# Altium project obc_ver2.PrjPcb (part 3 of 3)
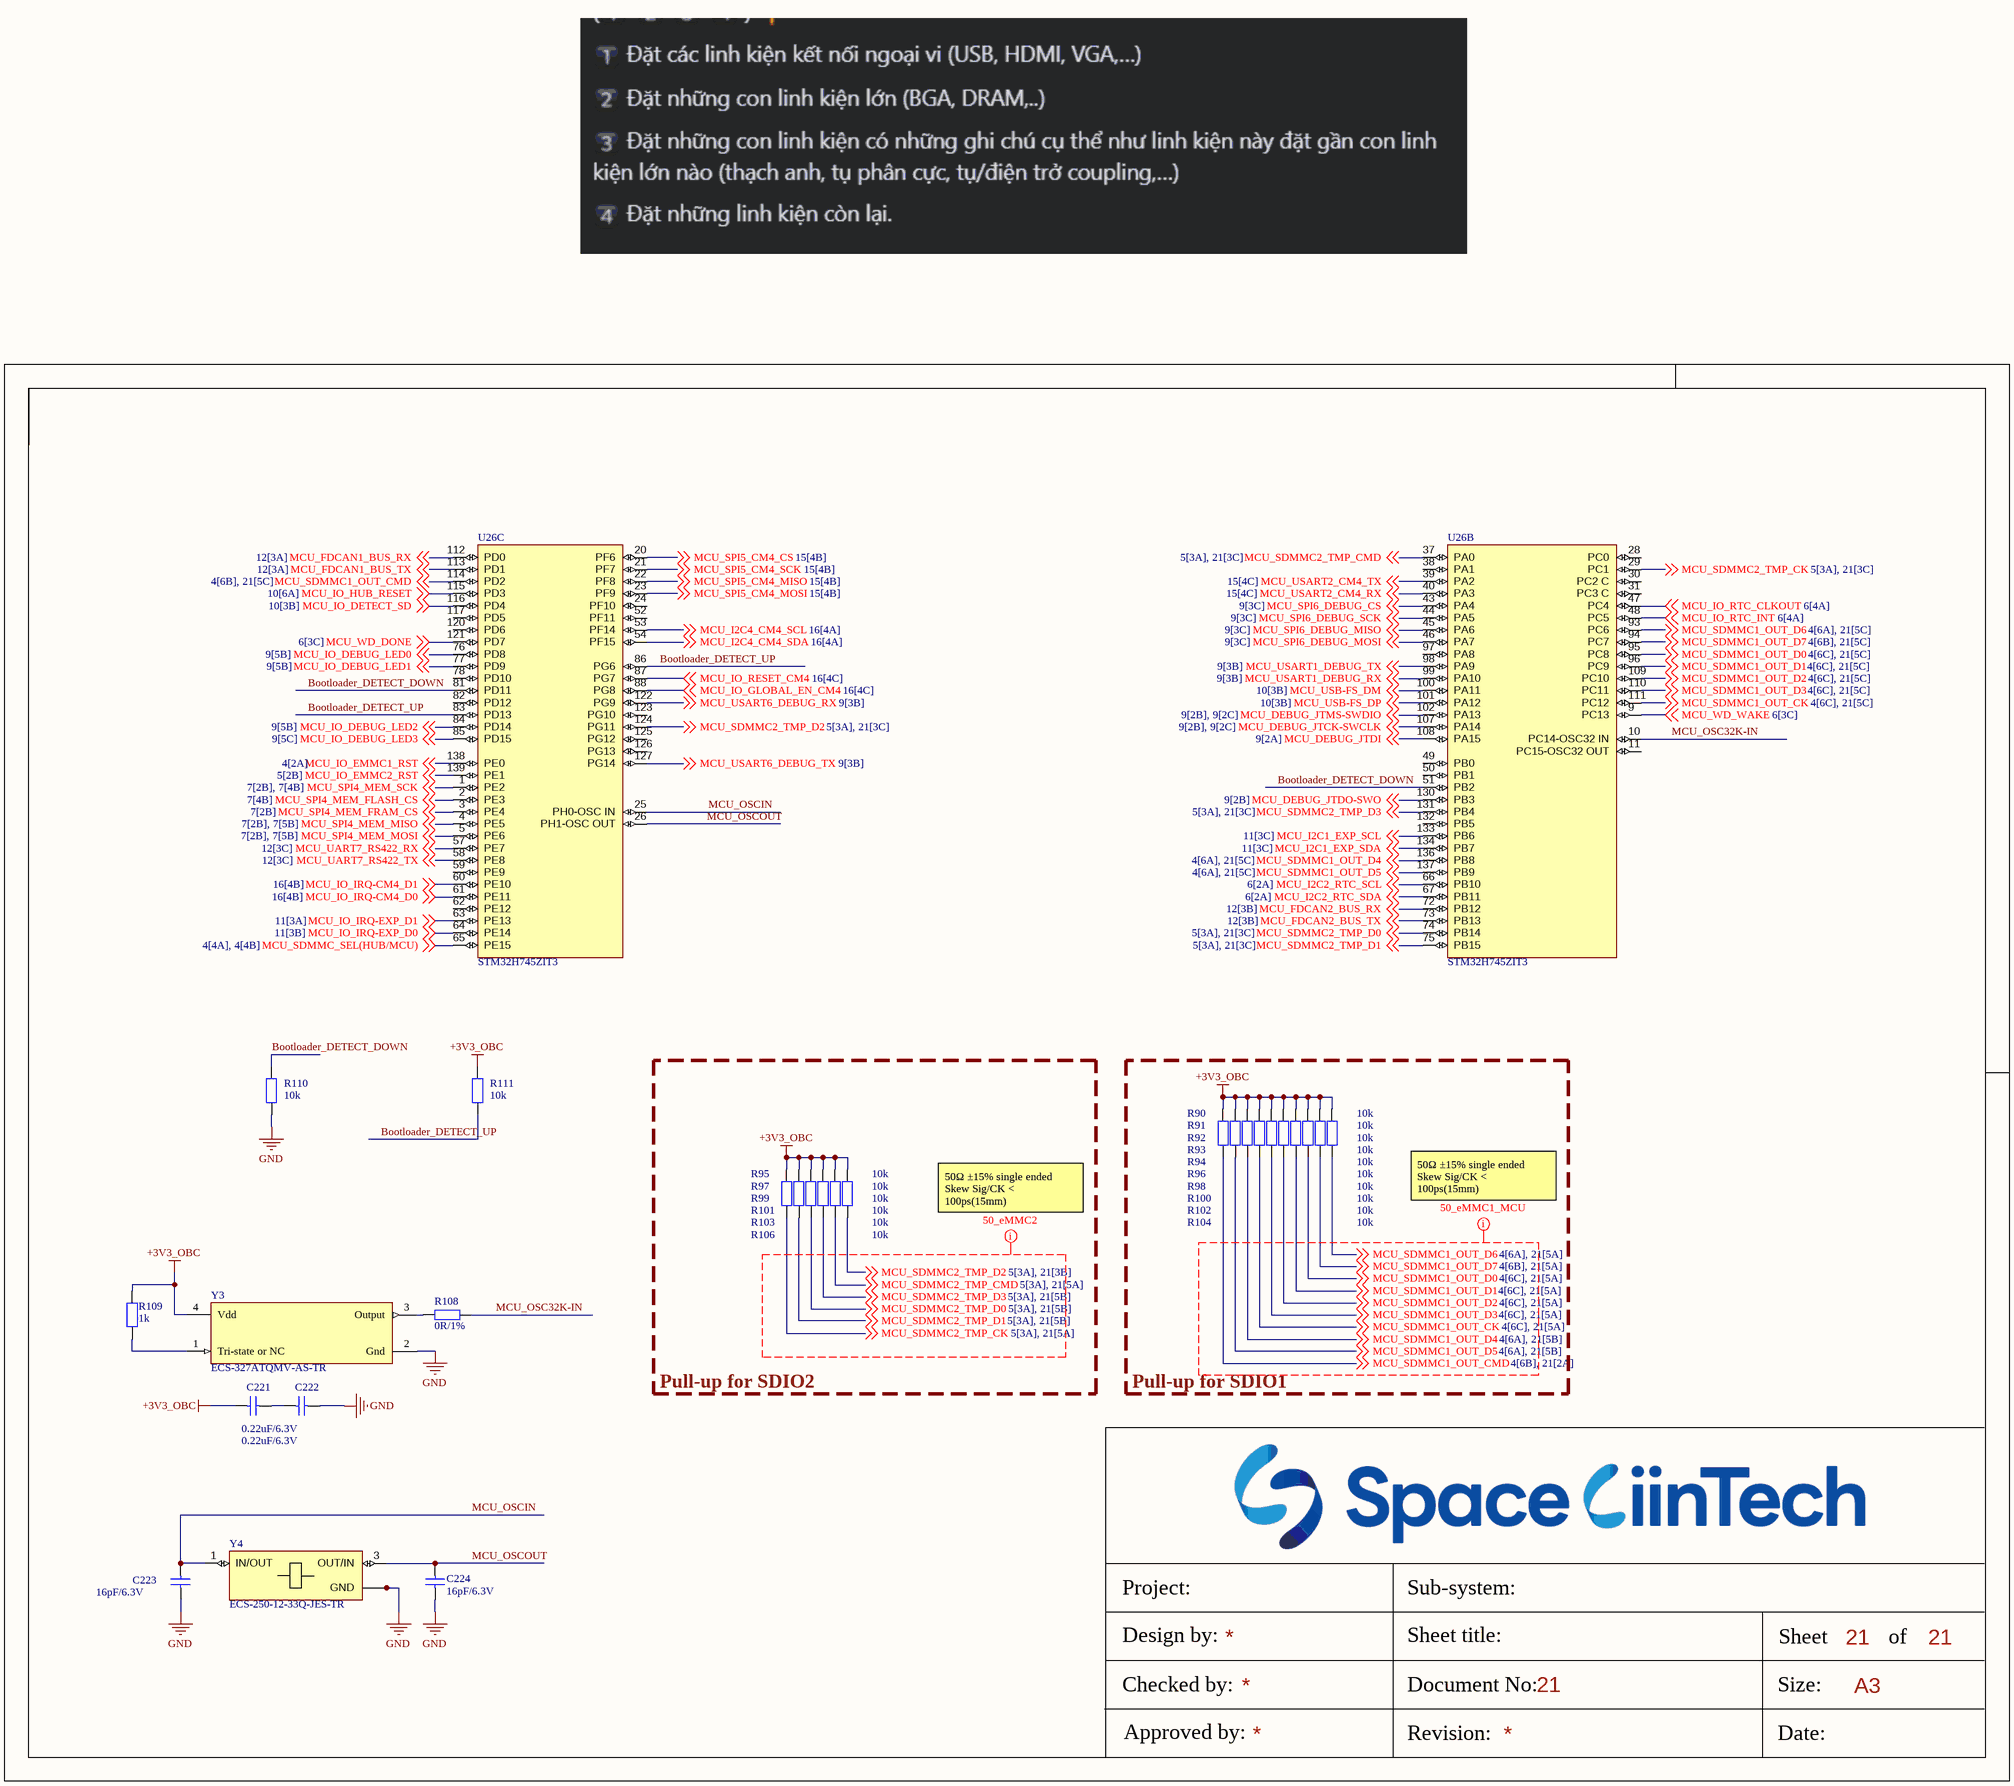
[diagram p23: obc-v2_MCU-PinOut.SchDoc]

## Nets that join several sheets
+3V3_CM4: obc-v2_POWER (C12.1 R3.2 U3.4 U3.5), obc-v2_CM4-PinOut (10 pins), obc-v2_CM4-SPI-UART (6 pins), obc-v2_CM4-IRQ-CTRL (10 pins), obc-v2_CM4-FUNCTION (D16.2 D17.2), obc-v2_CM4-CSI (R85.1 R86.1)
+3V3_CM4-OUT: obc-v2_CM4-PinOut (R63.1), obc-v2_CM4-POWER (CM4.84 CM4.86 R87.2 TP7.0)
+3V3_M2: obc-v2_POWER (C7.1 D2.2 U2.2 U2.4), obc-v2_CM4-M2 (16 pins)
+3V3_OBC: obc-v2_POWER (5 pins), obc-v2_OUT-eMMC (31 pins), obc-v2_TMP-eMMC (27 pins), obc-v2_RTC-WDOG (11 pins), obc-v2_FRAM-FLASH (8 pins), obc-v2_DEBUG (J6.1 J7.7), obc-v2_USB-HUB (31 pins), obc-v2_EXP-I2C-IRQ (8 pins), obc-v2_EXP-CAN-RS422 (10 pins), obc-v2_CM4-PinOut (5 pins), obc-v2_CM4-SPI-UART (5 pins), obc-v2_CM4-IRQ-CTRL (12 pins), obc-v2_MCU-POWER (41 pins), obc-v2_MCU-PinOut (20 pins)
+5V_AUX-Adaptor: obc-v2_POWER (7 pins), obc-v2_BOARD-CONNECT (J3.21 J18.05 J18.07 J18.09), obc-v2_CM4-PinOut (J20.2), obc-v2_CM4-POWER (14 pins)
+5V_EXP-ISO: obc-v2_BOARD-CONNECT (J3.9), obc-v2_EXP-I2C-IRQ (9 pins), obc-v2_EXP-CAN-RS422 (6 pins)
+5V_USB-Adaptor: obc-v2_POWER (C1.1 C3.1 U1.1 U1.2), obc-v2_BOARD-CONNECT (5 pins)
GND: obc-v2_POWER (6 pins), obc-v2_OUT-eMMC (39 pins), obc-v2_TMP-eMMC (29 pins), obc-v2_RTC-WDOG (11 pins), obc-v2_FRAM-FLASH (C65.2 C68.1 U10.4 U11.4), obc-v2_BOARD-CONNECT (C70.1 D5.2 J4.5 J18.04), obc-v2_DEBUG (12 pins), obc-v2_USB-HUB (36 pins), obc-v2_EXP-I2C-IRQ (C106.2 C110.2 U15.4 U16.4), obc-v2_EXP-CAN-RS422 (8 pins), obc-v2_CM4-PinOut (5 pins), obc-v2_CM4-SPI-UART (5 pins), obc-v2_CM4-IRQ-CTRL (6 pins), obc-v2_MCU-POWER (40 pins), obc-v2_MCU-PinOut (7 pins)
GND_CM4: obc-v2_POWER (11 pins), obc-v2_BOARD-CONNECT (12 pins), obc-v2_CM4-M2 (23 pins), obc-v2_CM4-PinOut (18 pins), obc-v2_CM4-SPI-UART (5 pins), obc-v2_CM4-IRQ-CTRL (6 pins), obc-v2_CM4-FUNCTION (7 pins), obc-v2_CM4-POWER (60 pins)
GND_EXP: obc-v2_BOARD-CONNECT (6 pins), obc-v2_EXP-I2C-IRQ (5 pins), obc-v2_EXP-CAN-RS422 (7 pins)
CAM0_CK_N: obc-v2_BOARD-CONNECT (J3.15), obc-v2_CM4-CSI (CM4.140)
CAM0_CK_P: obc-v2_BOARD-CONNECT (J3.36), obc-v2_CM4-CSI (CM4.142)
CAM0_D0_N: obc-v2_BOARD-CONNECT (J3.11), obc-v2_CM4-CSI (CM4.128)
CAM0_D0_P: obc-v2_BOARD-CONNECT (J3.32), obc-v2_CM4-CSI (CM4.130)
CAM0_D1_N: obc-v2_BOARD-CONNECT (J3.13), obc-v2_CM4-CSI (CM4.134)
CAM0_D1_P: obc-v2_BOARD-CONNECT (J3.34), obc-v2_CM4-CSI (CM4.136)
CM4_ENABLE: obc-v2_CM4-IRQ-CTRL (U25.2), obc-v2_CM4-FUNCTION (J23.1 R81.2)
CM4_I2C4_ToCAM_SCL: obc-v2_BOARD-CONNECT (J3.20), obc-v2_CM4-PinOut (CM4.37)
CM4_I2C4_ToCAM_SDA: obc-v2_BOARD-CONNECT (J3.41), obc-v2_CM4-PinOut (CM4.30)
CM4_I2C_ToCAM_SCL: obc-v2_BOARD-CONNECT (J3.17), obc-v2_CM4-CSI (CM4.35 R86.2)
CM4_I2C_ToCAM_SDA: obc-v2_BOARD-CONNECT (J3.38), obc-v2_CM4-CSI (CM4.36 R85.2)
CM4_I2CSlave_ToOBC_SCL: obc-v2_CM4-PinOut (CM4.38), obc-v2_CM4-IRQ-CTRL (R71.1 U27.3)
CM4_I2CSlave_ToOBC_SDA: obc-v2_CM4-PinOut (CM4.44), obc-v2_CM4-IRQ-CTRL (R73.1 U27.2)
CM4_IO_ToCAM_CAMIO0: obc-v2_BOARD-CONNECT (J3.37), obc-v2_CM4-CSI (CM4.97)
CM4_IO_ToCAM_CAMIO1: obc-v2_BOARD-CONNECT (J3.16), obc-v2_CM4-PinOut (CM4.24)
CM4_IO_ToCAM_SEL0: obc-v2_BOARD-CONNECT (J3.40), obc-v2_CM4-PinOut (CM4.29)
CM4_IO_ToCAM_SEL1: obc-v2_BOARD-CONNECT (J3.19), obc-v2_CM4-PinOut (CM4.50)
CM4_IO_ToOBC_IRQ0: obc-v2_CM4-PinOut (CM4.45), obc-v2_CM4-IRQ-CTRL (R77.1 U24.2)
CM4_IO_ToOBC_IRQ1: obc-v2_CM4-PinOut (CM4.40), obc-v2_CM4-IRQ-CTRL (R75.1 U24.3)
CM4_RESET: obc-v2_CM4-IRQ-CTRL (U25.3), obc-v2_CM4-FUNCTION (J27.1 R84.2)
CM4_SPI1_ISO_CS: obc-v2_CM4-PinOut (CM4.49), obc-v2_CM4-SPI-UART (R70.1 U22.5)
CM4_SPI1_ISO_MISO: obc-v2_CM4-PinOut (CM4.26), obc-v2_CM4-SPI-UART (U22.6)
CM4_SPI1_ISO_MOSI: obc-v2_CM4-PinOut (CM4.27), obc-v2_CM4-SPI-UART (U22.4)
CM4_SPI1_ISO_SCK: obc-v2_CM4-PinOut (CM4.25), obc-v2_CM4-SPI-UART (U22.3)
CM4_UART3_ToOBC_RX: obc-v2_CM4-PinOut (CM4.34), obc-v2_CM4-SPI-UART (U23.2)
CM4_UART3_ToOBC_TX: obc-v2_CM4-PinOut (CM4.54), obc-v2_CM4-SPI-UART (U23.3)
CM4_USB-FS_HUB_D_N: obc-v2_USB-HUB (U13.3), obc-v2_CM4-PinOut (U20.7)
CM4_USB-FS_HUB_D_P: obc-v2_USB-HUB (U13.4), obc-v2_CM4-PinOut (U20.8)
EMMC1_RST: obc-v2_OUT-eMMC (R5.2 U4.M5), obc-v2_MCU-PinOut (U26.138)
EMMC2_CLK: obc-v2_TMP-eMMC (U7.P6), obc-v2_MCU-PinOut (R95.1 U26.29)
EMMC2_CMD: obc-v2_TMP-eMMC (U7.P5), obc-v2_MCU-PinOut (R103.1 U26.37)
EMMC2_DAT0: obc-v2_TMP-eMMC (U7.K2), obc-v2_MCU-PinOut (R99.1 U26.74)
EMMC2_DAT1: obc-v2_TMP-eMMC (U7.N2), obc-v2_MCU-PinOut (R97.1 U26.75)
EMMC2_DAT2: obc-v2_TMP-eMMC (U7.K3), obc-v2_MCU-PinOut (R106.1 U26.124)
EMMC2_DAT3: obc-v2_TMP-eMMC (U7.N3), obc-v2_MCU-PinOut (R101.1 U26.131)
EMMC2_RST: obc-v2_TMP-eMMC (R9.2 U7.M5), obc-v2_MCU-PinOut (U26.139)
HUB_SDMMC1_CLK: obc-v2_OUT-eMMC (TP2.0 U6.19), obc-v2_USB-HUB (U13.21)
HUB_SDMMC1_CMD: obc-v2_OUT-eMMC (U6.23), obc-v2_USB-HUB (U13.24)
HUB_SDMMC1_D0: obc-v2_OUT-eMMC (U6.18), obc-v2_USB-HUB (U13.18)
HUB_SDMMC1_D1: obc-v2_OUT-eMMC (U6.16), obc-v2_USB-HUB (U13.17)
HUB_SDMMC1_D2: obc-v2_OUT-eMMC (U6.20), obc-v2_USB-HUB (U13.33)
HUB_SDMMC1_D3: obc-v2_OUT-eMMC (U6.22), obc-v2_USB-HUB (U13.32)
HUB_SDMMC1_D4: obc-v2_OUT-eMMC (U5.23), obc-v2_USB-HUB (U13.30)
HUB_SDMMC1_D5: obc-v2_OUT-eMMC (U5.22), obc-v2_USB-HUB (U13.23)
HUB_SDMMC1_D6: obc-v2_OUT-eMMC (U5.20), obc-v2_USB-HUB (U13.20)
HUB_SDMMC1_D7: obc-v2_OUT-eMMC (U5.18), obc-v2_USB-HUB (U13.19)
HUB_USB-FS_D_N: obc-v2_BOARD-CONNECT (D5.4), obc-v2_USB-HUB (U13.43)
HUB_USB-FS_D_P: obc-v2_BOARD-CONNECT (D5.6), obc-v2_USB-HUB (U13.42)
MCU_BOOT0: obc-v2_DEBUG (J7.1), obc-v2_MCU-POWER (R88.2 U26.135)
MCU_DEBUG_JTCK-SWCLK: obc-v2_DEBUG (J6.5 J7.4), obc-v2_MCU-PinOut (U26.107)
MCU_DEBUG_JTDI: obc-v2_DEBUG (J6.3), obc-v2_MCU-PinOut (U26.108)
MCU_DEBUG_JTDO-SWO: obc-v2_DEBUG (J6.6), obc-v2_MCU-PinOut (U26.130)
MCU_DEBUG_JTMS-SWDIO: obc-v2_DEBUG (J6.4 J7.5), obc-v2_MCU-PinOut (U26.102)
MCU_DETECT_SD: obc-v2_USB-HUB (R33.2 U13.14), obc-v2_MCU-PinOut (U26.116)
MCU_FDCAN1_BUS_RX: obc-v2_EXP-CAN-RS422 (U17.3), obc-v2_MCU-PinOut (U26.112)
MCU_FDCAN1_BUS_TX: obc-v2_EXP-CAN-RS422 (R49.1 U17.2), obc-v2_MCU-PinOut (U26.113)
MCU_FDCAN2_BUS_RX: obc-v2_EXP-CAN-RS422 (U18.3), obc-v2_MCU-PinOut (U26.72)
MCU_FDCAN2_BUS_TX: obc-v2_EXP-CAN-RS422 (R52.1 U18.2), obc-v2_MCU-PinOut (U26.73)
MCU_I2C1_EXP_SCL: obc-v2_EXP-I2C-IRQ (R45.1 U16.3), obc-v2_MCU-PinOut (U26.133)
MCU_I2C1_EXP_SDA: obc-v2_EXP-I2C-IRQ (R47.1 U16.2), obc-v2_MCU-PinOut (U26.134)
MCU_I2C2_RTC_SCL: obc-v2_RTC-WDOG (R13.1 U8.4), obc-v2_MCU-PinOut (U26.66)
MCU_I2C2_RTC_SDA: obc-v2_RTC-WDOG (R12.1 U8.5), obc-v2_MCU-PinOut (U26.67)
MCU_I2C4_CM4_SCL: obc-v2_CM4-IRQ-CTRL (R72.1 U27.6), obc-v2_MCU-PinOut (U26.53)
MCU_I2C4_CM4_SDA: obc-v2_CM4-IRQ-CTRL (R74.1 U27.7), obc-v2_MCU-PinOut (U26.54)
MCU_IO_DEBUG_LED0: obc-v2_DEBUG (R24.2), obc-v2_MCU-PinOut (U26.76)
MCU_IO_DEBUG_LED1: obc-v2_DEBUG (R25.2), obc-v2_MCU-PinOut (U26.77)
MCU_IO_DEBUG_LED2: obc-v2_DEBUG (R26.2), obc-v2_MCU-PinOut (U26.84)
MCU_IO_DEBUG_LED3: obc-v2_DEBUG (R27.2), obc-v2_MCU-PinOut (U26.85)
MCU_IO_GLOBAL_EN_CM4: obc-v2_CM4-IRQ-CTRL (R80.1 U25.7), obc-v2_MCU-PinOut (U26.88)
MCU_IO_HUB_RESET: obc-v2_USB-HUB (C76.1 R30.2 TP5.0 U13.38), obc-v2_MCU-PinOut (U26.115)
MCU_IO_IRQ-CM4_D0: obc-v2_CM4-IRQ-CTRL (R78.1 U24.7), obc-v2_MCU-PinOut (U26.61)
MCU_IO_IRQ-CM4_D1: obc-v2_CM4-IRQ-CTRL (R76.1 U24.6), obc-v2_MCU-PinOut (U26.60)
MCU_IO_IRQ-EXP_D0: obc-v2_EXP-I2C-IRQ (R40.1 U15.3), obc-v2_MCU-PinOut (U26.64)
MCU_IO_IRQ-EXP_D1: obc-v2_EXP-I2C-IRQ (R42.1 U15.2), obc-v2_MCU-PinOut (U26.63)
MCU_IO_RESET_CM4: obc-v2_CM4-IRQ-CTRL (R79.1 U25.6), obc-v2_MCU-PinOut (U26.87)
MCU_IO_RTC_CLKOUT: obc-v2_RTC-WDOG (R11.1 U8.3), obc-v2_MCU-PinOut (U26.47)
MCU_IO_RTC_INT: obc-v2_RTC-WDOG (R10.1 U8.7), obc-v2_MCU-PinOut (U26.48)
MCU_~{RST}: obc-v2_RTC-WDOG (C64.1 R16.1 R17.1 TP3.1), obc-v2_DEBUG (J6.8 J7.3), obc-v2_MCU-POWER (U26.27)
MCU_RS422_RX: obc-v2_EXP-CAN-RS422 (R57.1 U19.3), obc-v2_MCU-PinOut (U26.57)
MCU_RS422_TX: obc-v2_EXP-CAN-RS422 (U19.6), obc-v2_MCU-PinOut (U26.58)
MCU_SDMMC1_OUT_CK: obc-v2_OUT-eMMC (U6.13), obc-v2_MCU-PinOut (R93.1 U26.111)
MCU_SDMMC1_OUT_CMD: obc-v2_OUT-eMMC (U6.8), obc-v2_MCU-PinOut (R90.1 U26.114)
MCU_SDMMC1_OUT_D0: obc-v2_OUT-eMMC (U6.14), obc-v2_MCU-PinOut (R100.1 U26.95)
MCU_SDMMC1_OUT_D1: obc-v2_OUT-eMMC (U6.15), obc-v2_MCU-PinOut (R98.1 U26.96)
MCU_SDMMC1_OUT_D2: obc-v2_OUT-eMMC (U6.12), obc-v2_MCU-PinOut (R96.1 U26.109)
MCU_SDMMC1_OUT_D3: obc-v2_OUT-eMMC (U6.10), obc-v2_MCU-PinOut (R94.1 U26.110)
MCU_SDMMC1_OUT_D4: obc-v2_OUT-eMMC (U5.8), obc-v2_MCU-PinOut (R92.1 U26.136)
MCU_SDMMC1_OUT_D5: obc-v2_OUT-eMMC (U5.10), obc-v2_MCU-PinOut (R91.1 U26.137)
MCU_SDMMC1_OUT_D6: obc-v2_OUT-eMMC (U5.12), obc-v2_MCU-PinOut (R104.1 U26.93)
MCU_SDMMC1_OUT_D7: obc-v2_OUT-eMMC (U5.14), obc-v2_MCU-PinOut (R102.1 U26.94)
MCU_SDMMC_SEL(HUB/MCU): obc-v2_OUT-eMMC (6 pins), obc-v2_MCU-PinOut (U26.65)
MCU_SPI4_MEM_FLASH_CS: obc-v2_FRAM-FLASH (R23.1 U11.1), obc-v2_MCU-PinOut (U26.2)
MCU_SPI4_MEM_FRAM_CS: obc-v2_FRAM-FLASH (R20.1 U10.1), obc-v2_MCU-PinOut (U26.3)
MCU_SPI4_MEM_MISO: obc-v2_FRAM-FLASH (U10.2 U11.2), obc-v2_MCU-PinOut (U26.4)
MCU_SPI4_MEM_MOSI: obc-v2_FRAM-FLASH (U10.5 U11.5), obc-v2_MCU-PinOut (U26.5)
MCU_SPI4_MEM_SCK: obc-v2_FRAM-FLASH (U10.6 U11.6), obc-v2_MCU-PinOut (U26.1)
MCU_SPI5_CM4_CS: obc-v2_CM4-SPI-UART (U22.12), obc-v2_MCU-PinOut (U26.20)
MCU_SPI5_CM4_MISO: obc-v2_CM4-SPI-UART (U22.11), obc-v2_MCU-PinOut (U26.22)
MCU_SPI5_CM4_MOSI: obc-v2_CM4-SPI-UART (U22.13), obc-v2_MCU-PinOut (U26.23)
MCU_SPI5_CM4_SCK: obc-v2_CM4-SPI-UART (U22.14), obc-v2_MCU-PinOut (U26.21)
MCU_SPI6_DEBUG_CS: obc-v2_DEBUG (J12.1), obc-v2_MCU-PinOut (U26.43)
MCU_SPI6_DEBUG_MISO: obc-v2_DEBUG (J12.3), obc-v2_MCU-PinOut (U26.45)
MCU_SPI6_DEBUG_MOSI: obc-v2_DEBUG (J12.4), obc-v2_MCU-PinOut (U26.46)
MCU_SPI6_DEBUG_SCK: obc-v2_DEBUG (J12.2), obc-v2_MCU-PinOut (U26.44)
MCU_USART1_DEBUG_RX: obc-v2_DEBUG (J8.3), obc-v2_MCU-PinOut (U26.99)
MCU_USART1_DEBUG_TX: obc-v2_DEBUG (J8.2), obc-v2_MCU-PinOut (U26.98)
MCU_USART2_CM4_RX: obc-v2_CM4-SPI-UART (U23.6), obc-v2_MCU-PinOut (U26.40)
MCU_USART2_CM4_TX: obc-v2_CM4-SPI-UART (U23.7), obc-v2_MCU-PinOut (U26.39)
MCU_USART6_DEBUG_RX: obc-v2_DEBUG (J10.3), obc-v2_MCU-PinOut (U26.122)
MCU_USART6_DEBUG_TX: obc-v2_DEBUG (J10.2), obc-v2_MCU-PinOut (U26.127)
MCU_USB-FS_HUB_D_N: obc-v2_USB-HUB (U13.1), obc-v2_MCU-PinOut (U26.100)
MCU_USB-FS_HUB_D_P: obc-v2_USB-HUB (U13.2), obc-v2_MCU-PinOut (U26.101)
MCU_WD_DONE: obc-v2_RTC-WDOG (U9.4), obc-v2_MCU-PinOut (U26.121)
MCU_WD_WAKE: obc-v2_RTC-WDOG (U9.5), obc-v2_MCU-PinOut (U26.9)
NetJ3_4: obc-v2_BOARD-CONNECT (J3.4), obc-v2_EXP-CAN-RS422 (R50.2 R51.1 U17.7)
NetJ3_5: obc-v2_BOARD-CONNECT (J3.5), obc-v2_EXP-I2C-IRQ (R46.1 U16.6)
NetJ3_8: obc-v2_BOARD-CONNECT (J3.8), obc-v2_EXP-I2C-IRQ (R43.1 U15.7)
NetJ3_25: obc-v2_BOARD-CONNECT (J3.25), obc-v2_EXP-CAN-RS422 (R50.1 R54.1 U17.6)
NetJ3_26: obc-v2_BOARD-CONNECT (J3.26), obc-v2_EXP-I2C-IRQ (R48.1 U16.7)
NetJ3_29: obc-v2_BOARD-CONNECT (J3.29), obc-v2_EXP-I2C-IRQ (R41.1 U15.6)
Rx+: obc-v2_BOARD-CONNECT (J3.27), obc-v2_EXP-CAN-RS422 (R56.2 U19.14)
Rx-: obc-v2_BOARD-CONNECT (J3.28), obc-v2_EXP-CAN-RS422 (R56.1 U19.13)
Tx+: obc-v2_BOARD-CONNECT (J3.6), obc-v2_EXP-CAN-RS422 (R59.2 U19.11)
Tx-: obc-v2_BOARD-CONNECT (J3.7), obc-v2_EXP-CAN-RS422 (R59.1 U19.12)